# EAGLE design AD4DA-LightUI (EAGLE 7.7.0)
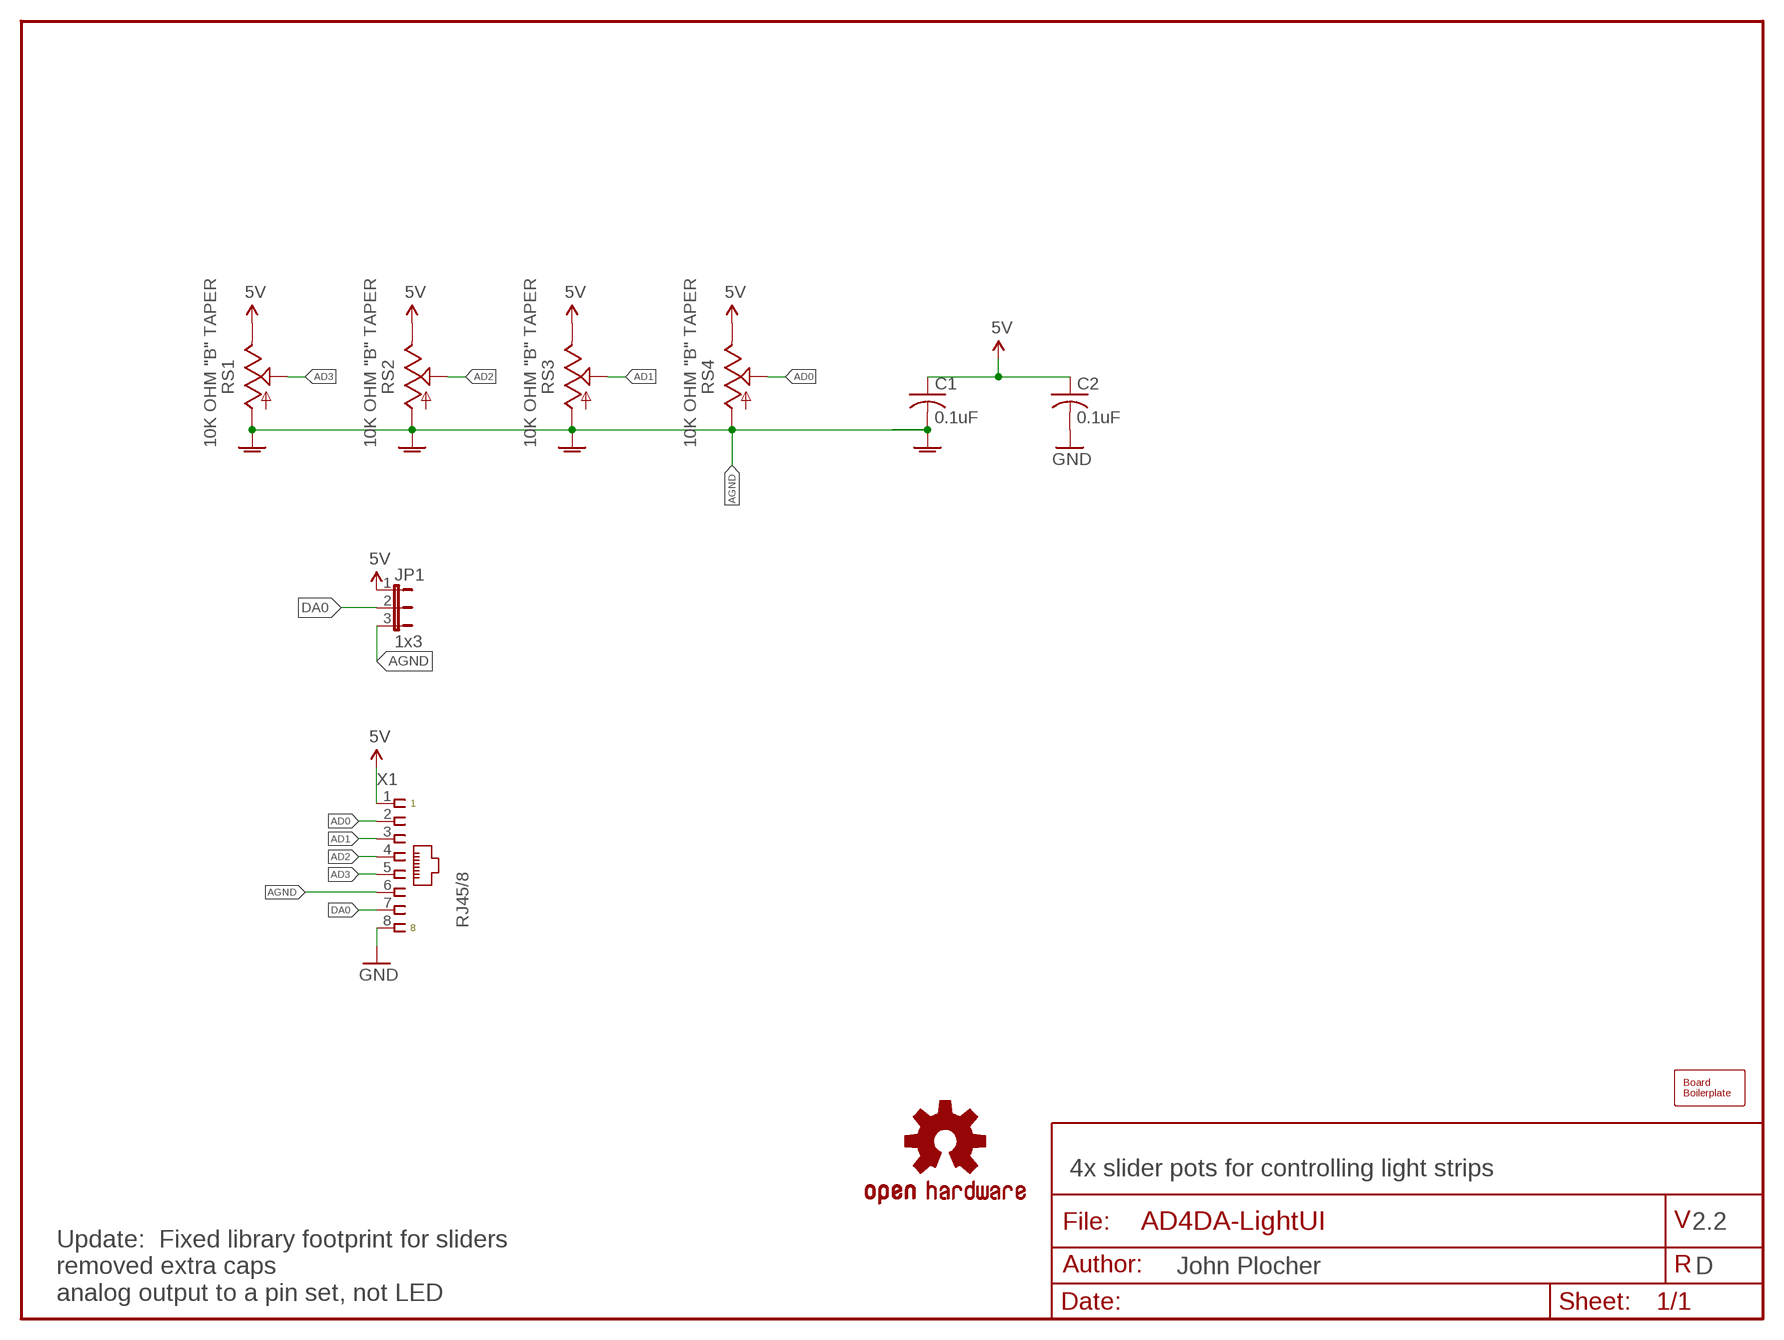
[diagram p0: schematic, sheet 1]

## Parts
BOARD1  10x7cm  BOARD80X70  [BOARD-DINRAIL-3.17INX7CM]
C1  0.1uF  CAPPTH1  [C050-024X044]
C2  0.1uF  CAPPTH1  [C050-024X044]
JP1  1x3  JUMPER-3PTH-LOCK  [1X03]
LOGO1  DOC-OSHW-LOGO-L  [OSHW-LOGO-L]
RS1  10K OHM "B" TAPER  R-SLIDE-POT-45MM  [SLIDER-45MM]
RS2  10K OHM "B" TAPER  R-SLIDE-POT-45MM  [SLIDER-45MM]
RS3  10K OHM "B" TAPER  R-SLIDE-POT-45MM  [SLIDER-45MM]
RS4  10K OHM "B" TAPER  R-SLIDE-POT-45MM  [SLIDER-45MM]
X1  RJ45/8  CONNECTOR-RJ45-FRONT  [RJ45-NO-SHIELD]

## Nets
5V: C1.1 C2.1 JP1.1 RS1.E RS2.E RS3.E RS4.E X1.1
AD0: RS4.S X1.2
AD1: RS3.S X1.3
AD2: RS2.S X1.4
AD3: RS1.S X1.5
AGND: C1.2 JP1.3 RS1.A RS1.AGND@0(AGND) RS1.AGND@1(AGND) RS2.A RS2.AGND@0(AGND) RS2.AGND@1(AGND) RS3.A RS3.AGND@0(AGND) RS3.AGND@1(AGND) RS4.A RS4.AGND@0(AGND) RS4.AGND@1(AGND) X1.6
DA0: JP1.2 X1.7
GND: C2.2 X1.8

## Notes on the sheet
- 4x slider pots for controlling light strips
- 2.2
- D
- Update:  Fixed library footprint for sliders
  removed extra caps
  analog output to a pin set, not LED

## Library data of the parts
BOARD1 = SPCoast:BOARD
C1 C2 = SPCoast:CAP*
JP1 = SPCoast:JUMPER-3
LOGO1 = SPCoast:DOC-OSHW-LOGO-: Open Source Hardware Logo This logo indicates the piece of hardware it is found on incorporates a OSHW license and/or adheres to the definition of open source hardware http://freedomdefined.org/OSHW Creative Commons - Attribution - ShareAlike 3.0
RS1-RS4 = SPCoast:R-SLIDE-POT: Slide-type potentiometer- COM-9119
X1 = SPCoast:CONNECTOR-RJ45: Tyco CORCOM Modular RJ Jacks No Shield; AMP: 520151-4; OPL: none

## Board
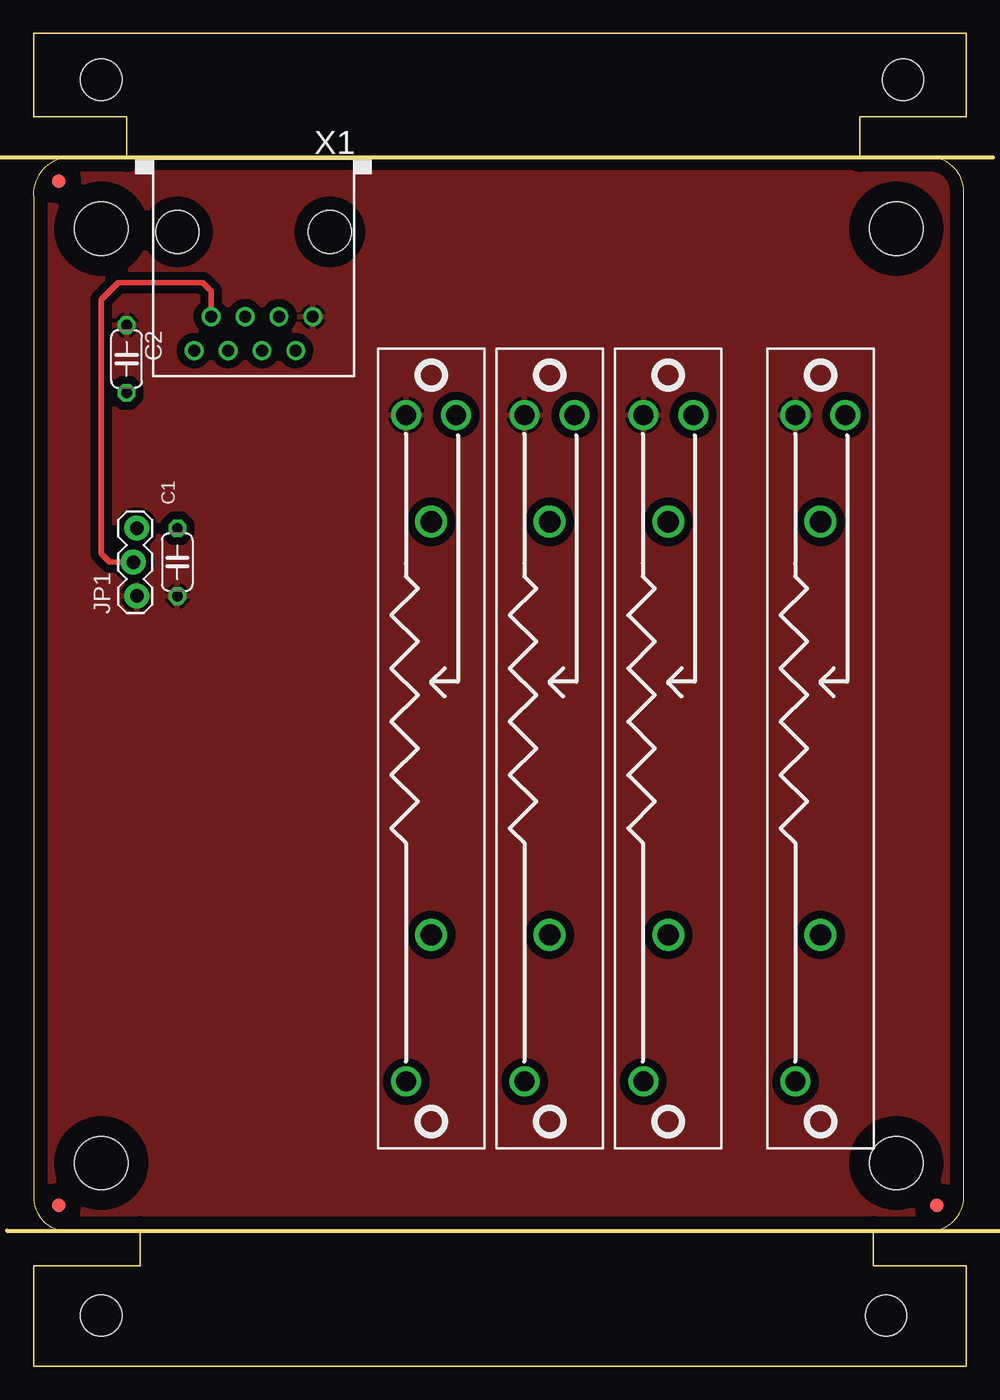
[diagram p1: board, top side]
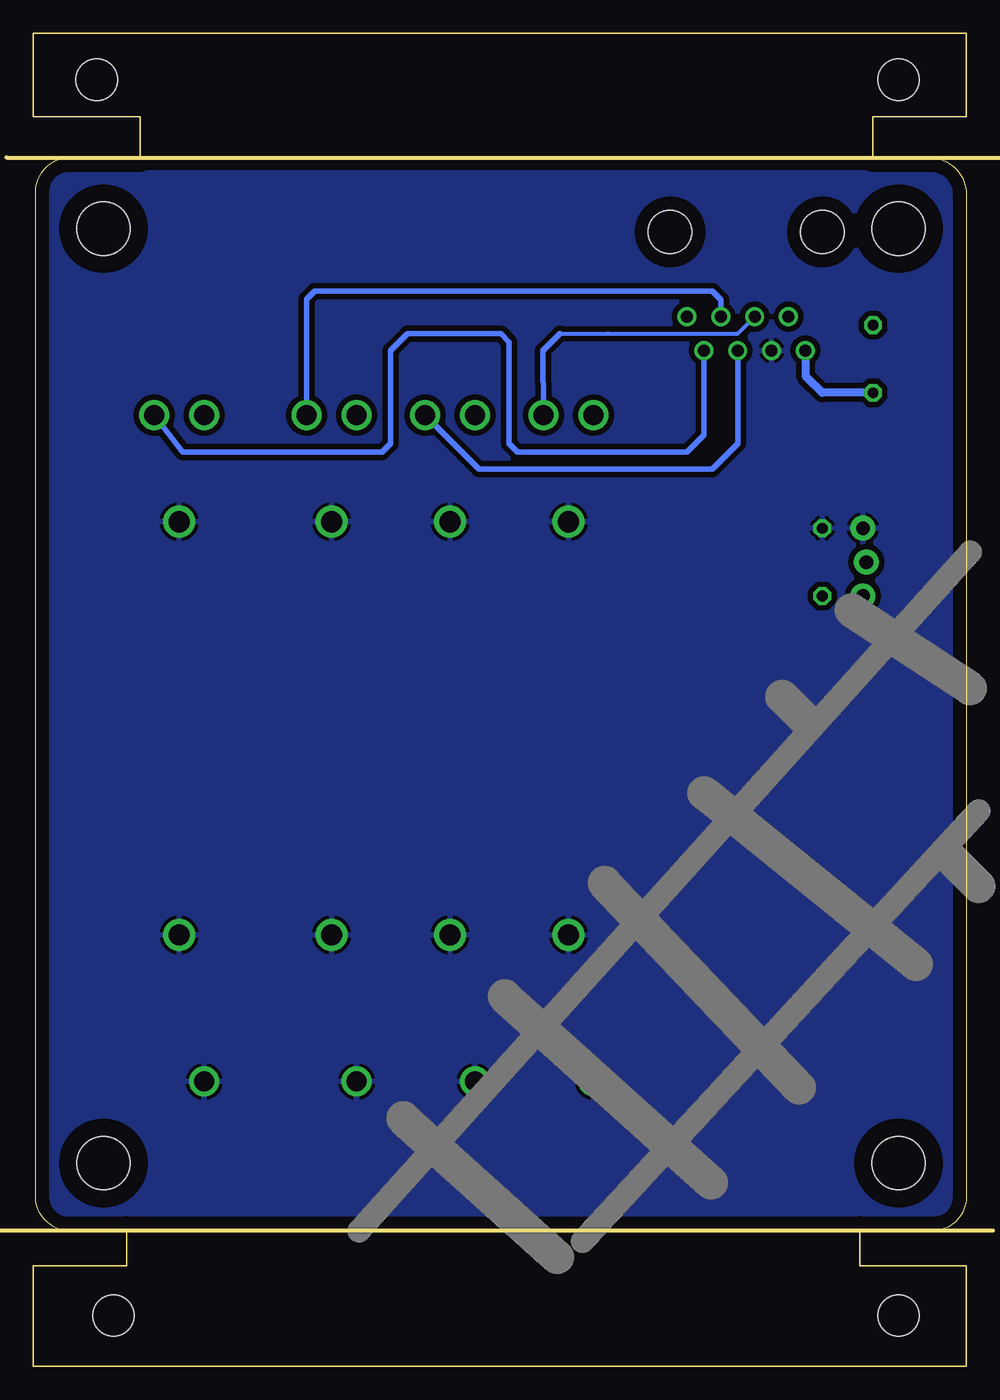
[diagram p2: board, bottom side, seen from below]

Size 70.01 x 100 mm. Coordinates in mm from the lower left corner, seen from the top.
Copper layers (1*16): Top 0.035mm / dielectric 1.5mm / Bottom 0.035mm
Design rules "default": minimum track width 10mil, minimum drill 0.6mm, track to track 8mil, track to pad 8mil, pad to pad 8mil, via to via 8mil, smd to smd 8mil, copper to edge 40mil, drill to drill 8mil, minimum pad ring 10mil, minimum via ring 8mil, stop-mask expansion 4mil, vias tented up to drill 0mil, thermal gap 10mil

### Footprints (pad centres in the part's own frame; a part is rotated, then mirrored left to right if it is on the bottom)
BOARD-DINRAIL-3.17INX7CM = smd 1 x 1: 1 1.905,12.065; 2 67.79,12.065; 3 1.905,88.9 | hole 4: 64.742,15.24; 5.08,85.344; 64.742,85.344; 5.08,15.24 | hole 3.1: 5.08,96.52; 65.25,96.52; 5.08,3.81; 63.98,3.81
C050-024X044 = drill 0.813 octagon: 1 -2.54,0; 2 2.54,0
1X03 = drill 1.016 pad 1.88: 1 0,-0.127; 2 2.54,0.127; 3 5.08,-0.127
SLIDER-45MM = drill 1.5: A 25,-1.875; E -25,-1.875; S -25,1.875 | drill 1.6: AGND@0 -17,0; AGND@1 14,0
RJ45-NO-SHIELD = drill 0.9 pad 1.4: 1 -4.445,6.35; 2 -3.175,8.89; 3 -1.905,6.35; 4 -0.635,8.89; 5 0.635,6.35; 6 1.905,8.89; 7 3.175,6.35; 8 4.445,8.89 | hole 3.251: -5.715,0; 5.715,0

### Placement (x,y rotation side)
BOARD1  0.01,0 0 top
C1  10.81,60.33 90 top
C2  7,75.56 270 top
JP1  7.63,57.78 90 top
LOGO1  5.09,15.24 0 top
RS1  29.86,46.35 270 top
RS2  38.75,46.35 270 top
RS3  47.64,46.35 270 top
RS4  59.07,46.35 270 top
X1  16.52,85.09 180 top

### Tracks (layer width: path | path; a pad name or v marks a point on that pad's centre or on a via)
5V
  pour Top (isolate 0.61): 0.01,89.53 69.86,89.53 69.86,11.43 0.01,11.43
AD0
  Bottom 0.406: RS4.S 58.8,68.58 43.83,68.58 43.19,69.22 43.19,76.2 41.92,77.47 34.94,77.47 34.3,76.83 34.3,69.22 33.67,68.58 20.97,68.58 19.7,69.85 X1.2
AD1
  Bottom 0.406: X1.3 18.43,80.01 19.06,80.64 20.33,80.64 48.91,80.64 49.51,80.04 RS3.S
AD2
  Bottom 0.406: RS2.S 36.58,67.31 19.06,67.31 17.16,69.22 X1.4
AD3
  Bottom 0.305: 30.49,77.47 26.89,77.47 17.16,77.47 X1.5
  Bottom 0.406: RS1.S 31.76,76.2 30.49,77.47
AGND
  pour Bottom (isolate 0.406): 0.01,89.53 69.86,89.53 69.86,11.43 0.01,11.43
  pour Bottom: 25.41,19.05 62.24,19.05 62.24,66.04 27.95,66.04 25.41,66.04
DA0
  Top 0.406: JP1.2 5.73,60.33 5.09,60.96 5.09,80.01 6.36,81.28 12.71,81.28 13.35,80.64 X1.7
GND
  Bottom 0.61: X1.8 12.08,74.3 10.81,73.03 C2.2

### Text on the board
tDocu: v2.2 | R G B | W | AD3 | AD2 | AD1 | AD0 | DA0 | AD3 | AD2 | AD1 | AD0 | +5 | Dgnd | Agnd | LightUI | Agnd | DA0 | +5 | D/A out | 2018-07 | OSHW | LightUI | v2.2
bDocu: Made in the PCR, Coast Division, NMRA | LightUI | Solder Side | Go Bears! | Model Railroading is fun! | www . SPCoast . com
Changes: Shrunk board size